# EAGLE design RFRxTx_2550_a (EAGLE 7.3.0)
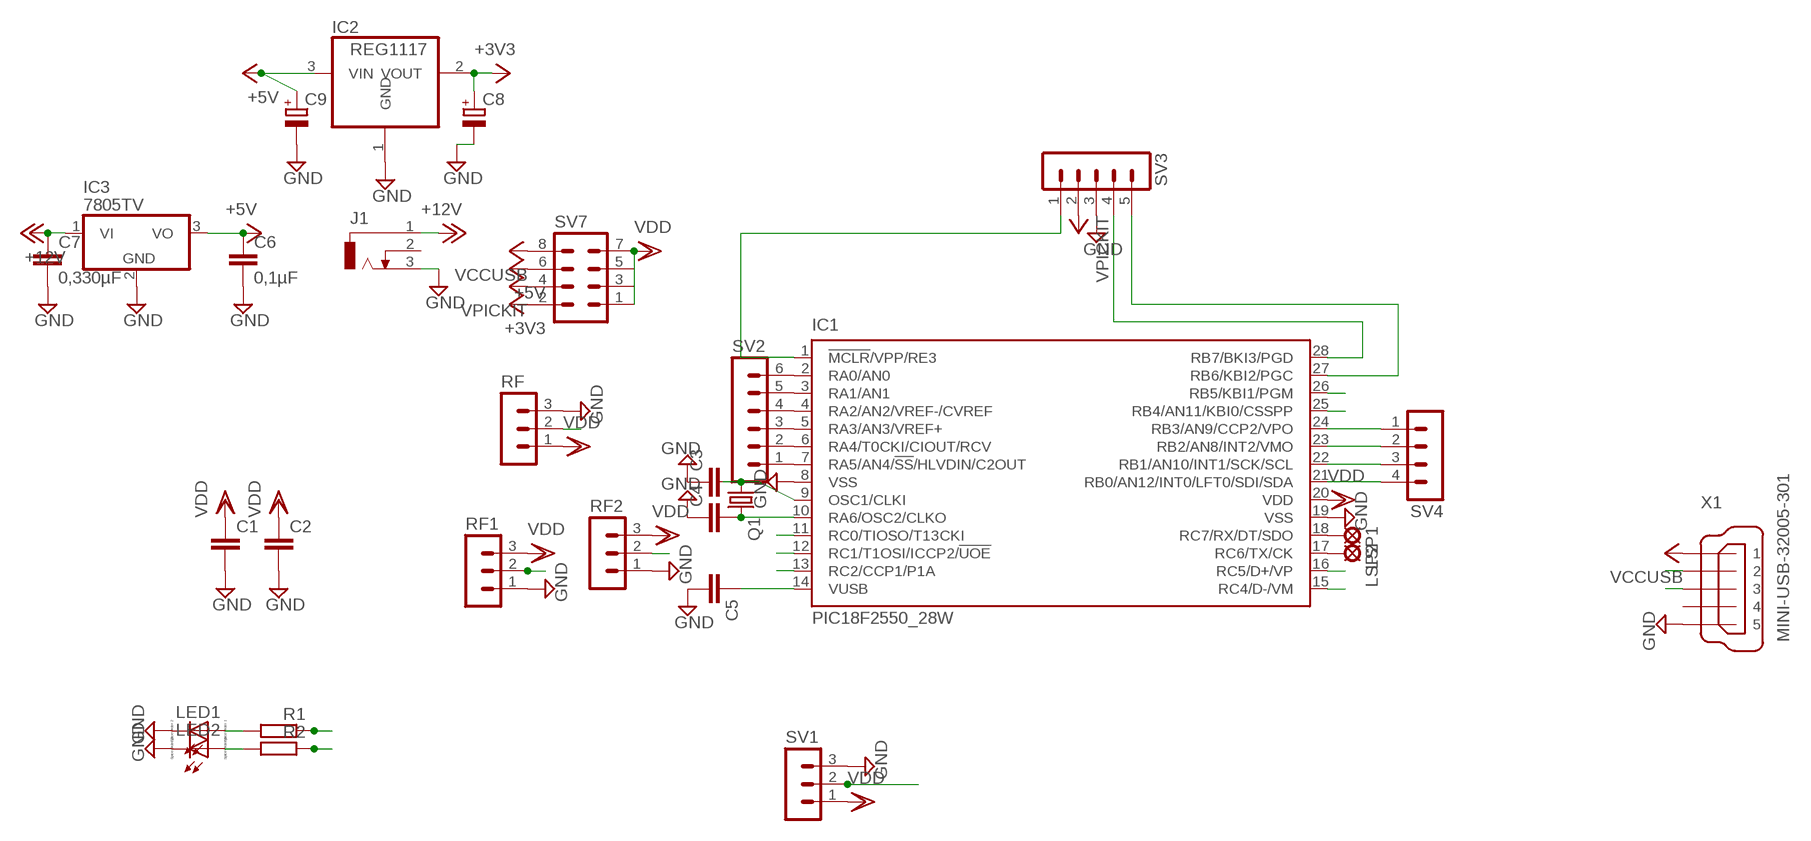
[diagram p0: schematic, sheet 1]

## Parts
C1  C-EUC0805  [C0805]
C2  C-EUC0805  [C0805]
C3  C-EUC0805  [C0805]
C4  C-EUC0805  [C0805]
C5  C-EUC0805  [C0805]
C6  0,1µF  C-EUC0805  [C0805]
C7  0,330µF  C-EUC0805  [C0805]
C8  CPOL-EU153CLV-0405  [153CLV-0405]
C9  CPOL-EU153CLV-0405  [153CLV-0405]
IC1  PIC18F2550_28W  [SO28W]
IC2  REG1117  [SOT223]
IC3  7805TV  [TO220V]
J1  DCJ0303  [DCJ0303]
LED1  LED_ESML0603  [LED_SML0603]
LED2  LED_ESML0603  [LED_SML0603]
LSP1  LSP10  [LSP10]
LSP2  LSP10  [LSP10]
Q1  CRYSTALSM49  [SM49]
R1  R-EU_R0805  [R0805]
R2  R-EU_R0805  [R0805]
RF  MA03-1  [MA03-1]
RF1  MA03-1  [MA03-1]
RF2  MA03-1  [MA03-1]
SV1  MA03-1  [MA03-1]
SV2  MA06-1  [MA06-1]
SV3  MA05-1  [MA05-1]
SV4  MA04-1  [MA04-1]
SV7  MA04-2  [MA04-2]
X1  MINI-USB-32005-301  [32005-301]

## Nets
+3V3: C8.+ IC2.2(VOUT) SV7.2
+5V: C6.1 C9.+ IC2.3(VIN) IC3.3(VO) SV7.6
+12V: C7.1 IC3.1(VI) J1.1
CCP2: IC1.24(RB3/AN9/CCP2/VPO) SV1.2 SV4.1
D+: IC1.16(RC5/D+/VP) X1.3
D-: IC1.15(RC4/D-/VM) X1.2
GND: C1.2 C2.2 C3.1 C4.1 C5.2 C6.2 C7.2 C8.- C9.- IC1.8(VSS) IC1.19(VSS) IC2.1(GND) IC3.2(GND) J1.3 LED1.C LED2.C RF1.1 RF2.1 RF.3 SV1.3 SV3.3 X1.5
IR: IC1.13(RC2/CCP1/P1A) RF1.2
N$1: IC1.7(RA5/AN4/!SS!/HLVDIN/C2OUT) SV2.1
N$2: IC1.6(RA4/T0CKI/CIOUT/RCV) SV2.2
N$3: IC1.5(RA3/AN3/VREF+) SV2.3
N$4: IC1.4(RA2/AN2/VREF-/CVREF) SV2.4
N$5: IC1.3(RA1/AN1) SV2.5
N$6: IC1.2(RA0/AN0) SV2.6
N$9: IC1.23(RB2/AN8/INT2/VMO) SV4.2
N$10: IC1.1(!MCLR!/VPP/RE3) SV3.1
N$11: IC1.28(RB7/BKI3/PGD) SV3.4
N$12: IC1.27(RB6/KBI2/PGC) SV3.5
N$13: IC1.22(RB1/AN10/INT1/SCK/SCL) SV4.3
N$14: IC1.21(RB0/AN12/INT0/LFT0/SDI/SDA) SV4.4
N$15: IC1.18(RC7/RX/DT/SDO) LSP1.MP
N$16: IC1.17(RC6/TX/CK) LSP2.MP
N$23: C4.2 IC1.10(RA6/OSC2/CLKO) Q1.2
N$24: C3.2 IC1.9(OSC1/CLKI) Q1.1
N$30: C5.1 IC1.14(VUSB)
N$35: LED1.A R1.2
N$36: LED2.A R2.2
RB4: IC1.25(RB4/AN11/KBI0/CSSPP) R2.1
RB5: IC1.26(RB5/KBI1/PGM) R1.1
RC0: IC1.11(RC0/TIOSO/T13CKI) RF2.2
RF: IC1.12(RC1/T1OSI/ICCP2/!UOE) RF.2
VCC: SV3.2 SV7.4 ; supply symbol labelled VPICKIT
VDD: C1.1 C2.1 IC1.20(VDD) RF1.3 RF2.3 RF.1 SV1.1 SV7.1 SV7.3 SV7.5 SV7.7
VUSB: SV7.8 X1.1 ; supply symbol labelled VCCUSB
Unconnected: J1.2 X1.4

## Library data of the parts
C1-C5 = rcl:C-EU: CAPACITOR, European symbol
C6 C7 = resistor:C-EU: CAPACITOR, European symbol
C8 C9 = rcl:CPOL-EU: POLARIZED CAPACITOR, European symbol
IC1 = microchip:PIC18F2*_28: USB Microcontrollers with nanoWatt Technology High-Performance, Enhanced Flash, 28/40/44-Pin, Source: http://ww1.microchip.com/downloads/en/devicedoc/39632c.pdf; MF: MICROCHIP; MPN: PIC18F2550-I/SO; OC_FARNELL: 9321268; OC_NEWARK: 73K1297
IC2 = burr-brown:REG1117: 800mA and 1A Low Dropout (LDO) Positive Regulator 1.8V, 2.5V, 2.85V, 3.3V, 5V, and Adj; MPN: REG1117; OC_FARNELL: 1097566; OC_NEWARK: 14P6981
IC3 = linear:78*: Positive VOLTAGE REGULATOR Source: http://cache.national.com/ds/LM/LM78L05.pdf http://www.fairchildsemi.com/ds/LM/LM7805.pdf
J1 = con-jack:DCJ0303: DC POWER JACK Source: DCJ0303.pdf; OC_FARNELL: unknown; OC_NEWARK: unknown
LED1 LED2 = eagle-ltspice:LED_E: LED Source: http://www.osram.convergy.de Source: www.luxeon.com Source: www.kingbright.com; SPICEMODEL: NONE; SPICEPREFIX: D; SPICETYPE: diode
LSP1 LSP2 = solpad:LSP10: SOLDER PAD drill 1.0 mm, distributor Buerklin, 12H555
Q1 = crystal:CRYSTAL: CRYSTAL; OC_FARNELL: unknown; OC_NEWARK: unknown
R1 R2 = rcl:R-EU_: RESISTOR, European symbol
RF RF1 RF2 SV1 = con-lstb:MA03-1: PIN HEADER; OC_FARNELL: unknown; OC_NEWARK: unknown
SV2 = con-lstb:MA06-1: PIN HEADER; OC_FARNELL: unknown; OC_NEWARK: unknown
SV3 = con-lstb:MA05-1: PIN HEADER; OC_FARNELL: unknown; OC_NEWARK: unknown
SV4 = con-lstb:MA04-1: PIN HEADER; OC_FARNELL: unknown; OC_NEWARK: unknown
SV7 = con-lstb:MA04-2: PIN HEADER; OC_FARNELL: unknown; OC_NEWARK: unknown
X1 = con-cypressindustries:MINI-USB-: MINI USB-B Conector Source: www.cypressindustries.com; OC_FARNELL: unknown; OC_NEWARK: unknown

## Board
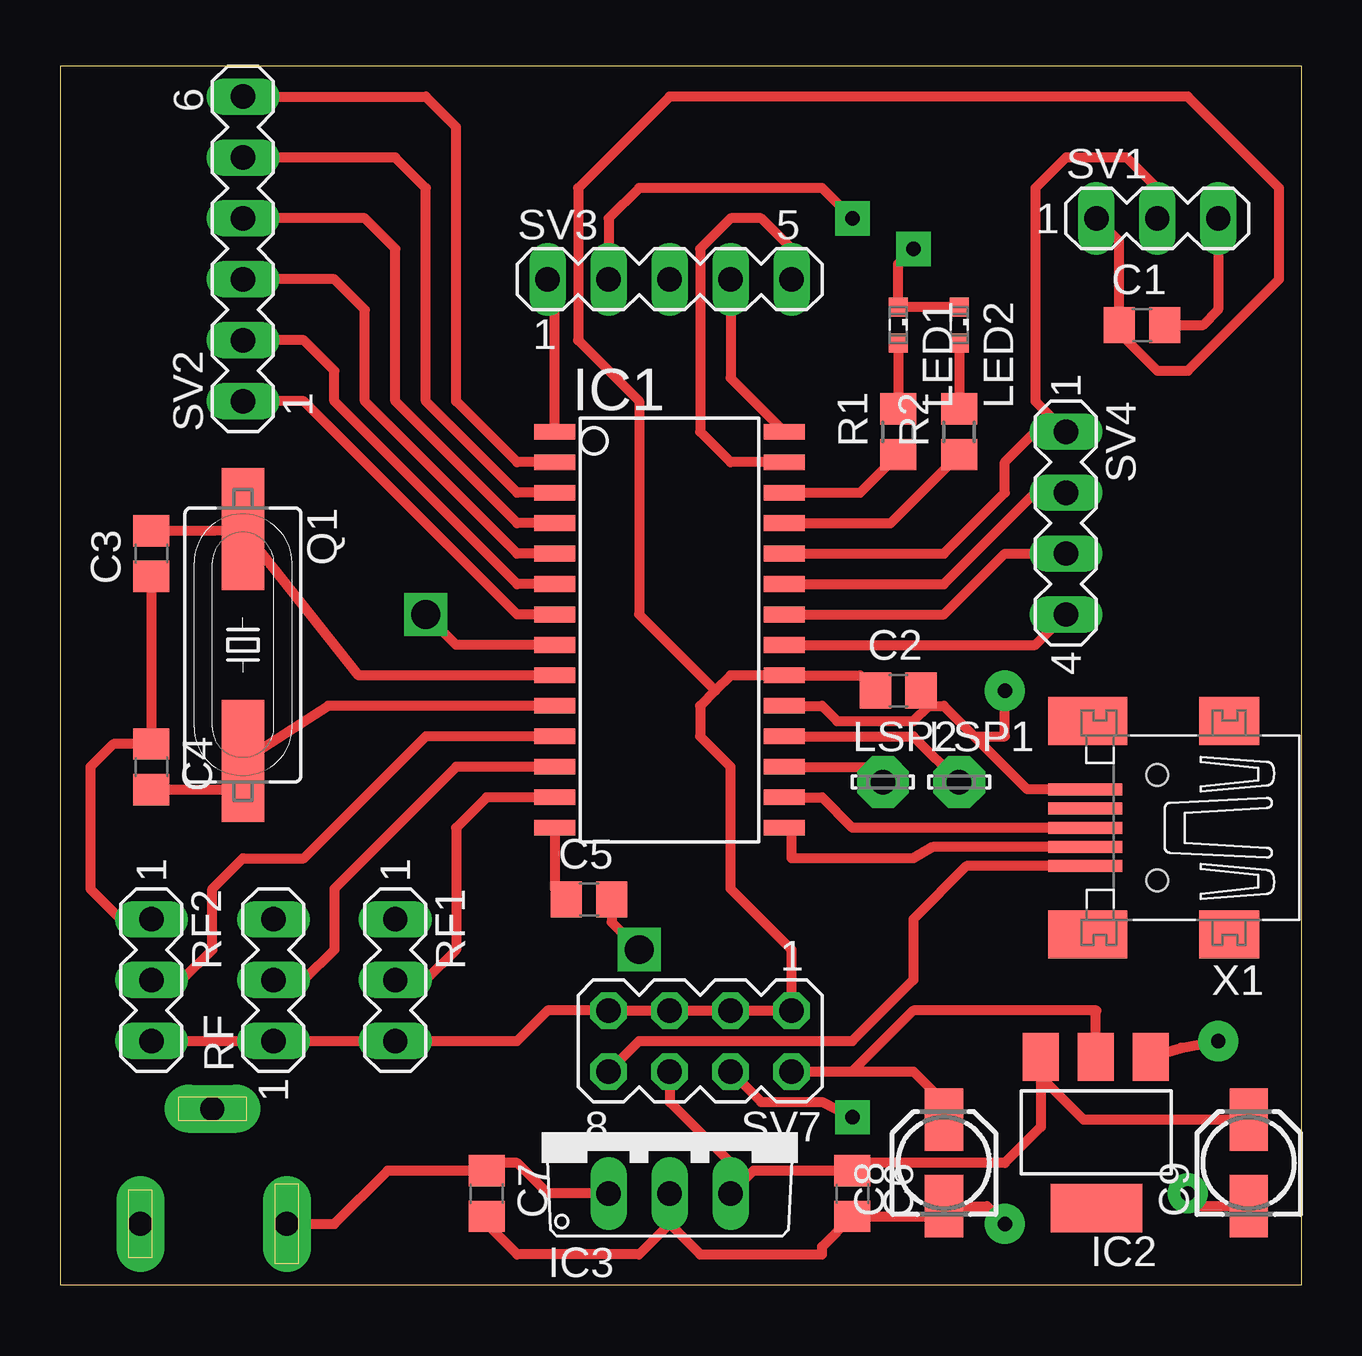
[diagram p1: board, top side]
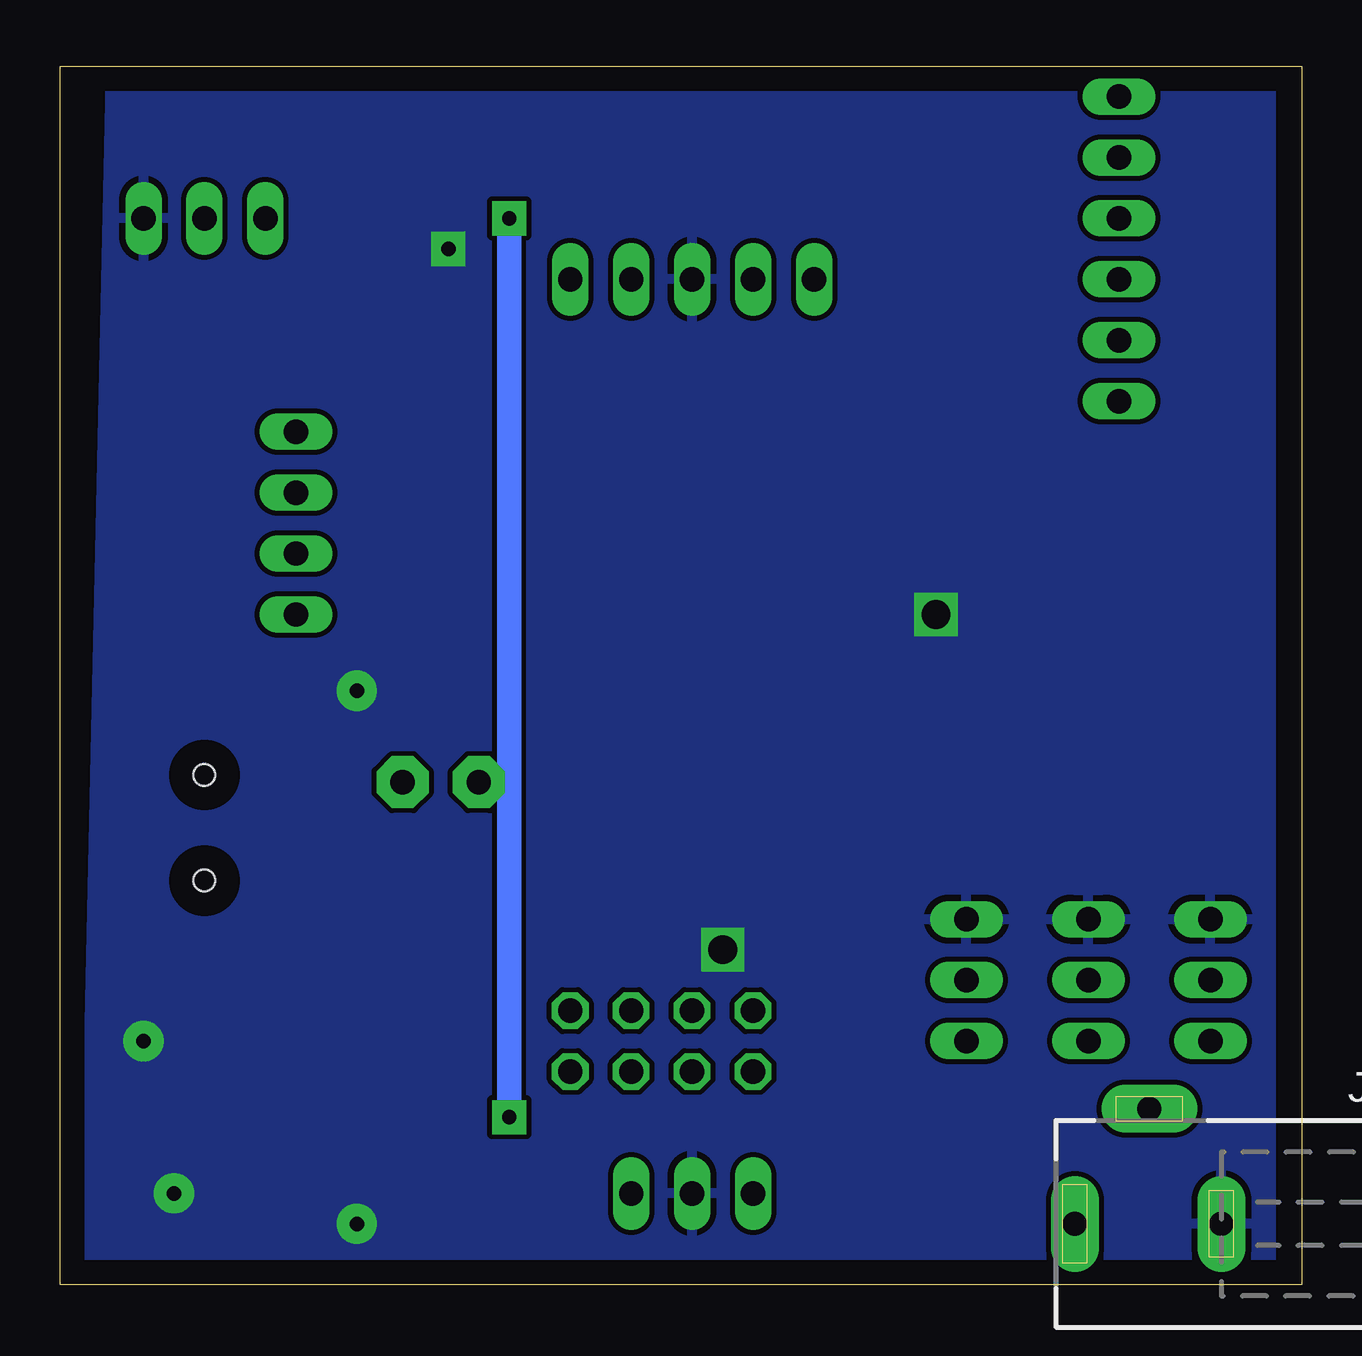
[diagram p2: board, bottom side, seen from below]

Size 51.74 x 50.79 mm. Coordinates in mm from the lower left corner, seen from the top.
Outline: 0,0 51.74,0 51.74,50.79 0,50.79 0,0
Copper layers (1*16): Top 0.035mm / dielectric 1.5mm / Bottom 0.035mm
Design rules "default *": minimum track width 10mil, minimum drill 24mil, track to track 8mil, track to pad 8mil, pad to pad 8mil, via to via 8mil, smd to smd 8mil, copper to edge 40mil, drill to drill 8mil, minimum pad ring 8mil, minimum via ring 8mil, stop-mask expansion 4mil, vias tented up to drill 0mil, thermal gap 10mil

### Footprints (pad centres in the part's own frame; a part is rotated, then mirrored left to right if it is on the bottom)
C0805 = smd 1.3 x 1.5: 1 -0.95,0; 2 0.95,0
153CLV-0405 = smd 2.6 x 1.6: + 1.8,0; - -1.8,0
SO28W = smd 0.65 x 1.7: 1 -7.62,-4.78; 2 -6.35,-4.78; 3 -5.08,-4.78; 4 -3.81,-4.78; 5 -2.54,-4.78; 6 -1.27,-4.78; 7 0,-4.78; 8 1.27,-4.78; 9 2.54,-4.78; 10 3.81,-4.78; 11 5.08,-4.78; 12 6.35,-4.78; 13 7.62,-4.78; 14 8.89,-4.78; 15 8.89,4.78; 16 7.62,4.78; 17 6.35,4.78; 18 5.08,4.78; 19 3.81,4.78; 20 2.54,4.78; 21 1.27,4.78; 22 0,4.78; 23 -1.27,4.78; 24 -2.54,4.78; 25 -3.81,4.78; 26 -5.08,4.78; 27 -6.35,4.78; 28 -7.62,4.78
SOT223 = smd 1.499 x 2.007: 1 -2.261,-3.15; 2 0.025,-3.15; 3 2.311,-3.15 | smd 3.81 x 2.007: 4 0,3.15
TO220V = drill 1.016 long: 1 -2.54,-2.54; 2 0,-2.54; 3 2.54,-2.54
DCJ0303 = drill 1 pad 2 long: 1 0,3.1; 2 4.8,0; 3 0,-3
LED_SML0603 = smd 0.8 x 0.8: A 0.75,0; C -0.75,0
LSP10 = drill 1.016 pad 2.159 octagon: MP 0,0
SM49 = smd 5.08 x 1.778: 1 -4.826,0; 2 4.826,0
R0805 = smd 1.3 x 1.5: 1 -0.95,0; 2 0.95,0
MA03-1 = drill 1.016 long: 1 -2.54,0; 2 0,0; 3 2.54,0
MA06-1 = drill 1.016 long: 1 -6.35,0; 2 -3.81,0; 3 -1.27,0; 4 1.27,0; 5 3.81,0; 6 6.35,0
MA05-1 = drill 1.016 long: 1 -5.08,0; 2 -2.54,0; 3 0,0; 4 2.54,0; 5 5.08,0
MA04-1 = drill 1.016 long: 1 -3.81,0; 2 -1.27,0; 3 1.27,0; 4 3.81,0
MA04-2 = drill 1.016 octagon: 1 -3.81,-1.27; 2 -3.81,1.27; 3 -1.27,-1.27; 4 -1.27,1.27; 5 1.27,-1.27; 6 1.27,1.27; 7 3.81,-1.27; 8 3.81,1.27
32005-301 = smd 3.1 x 0.5: 1 3,1.6; 2 3,0.8; 3 3,0; 4 3,-0.8; 5 3,-1.6 | smd 2.5 x 2: M1 -3,-4.45; M2 -3,4.45 | smd 3.3 x 2: M3 2.9,4.45; M4 2.9,-4.45 | hole 0.9: 0,2.2; 0,-2.2

### Placement (x,y rotation side)
C1  45.09,40.01 0 top
C2  34.93,24.77 0 top
C3  3.81,30.48 90 top
C4  3.81,21.59 270 top
C5  22.04,16.06 0 top
C6  33.02,3.81 270 top
C7  17.78,3.81 270 top
C8  36.83,5.08 90 top
C9  49.53,5.08 90 top
IC1  25.4,27.94 270 top
IC2  43.18,6.35 180 top
IC3  25.4,6.35 0 top
J1  6.35,2.54 90 bottom
LED1  34.93,40.01 270 top
LED2  37.47,40.01 270 top
LSP1  37.47,20.95 0 top
LSP2  34.29,20.95 0 top
Q1  7.62,26.67 270 top
R1  34.93,35.56 90 top
R2  37.47,35.56 90 top
RF  8.89,12.7 90 top
RF1  13.97,12.7 270 top
RF2  3.81,12.7 270 top
SV1  45.72,44.45 0 top
SV2  7.62,43.18 90 top
SV3  25.4,41.91 0 top
SV4  41.91,31.75 270 top
SV7  26.67,10.16 180 top
X1  45.72,19.05 180 top

### Tracks (layer width: path | path; a pad name or v marks a point on that pad's centre or on a via)
+3V3
  Top 0.406: SV7.2 33.02,8.89 | 33.02,8.89 35.56,8.89 36.83,7.62 C8.+ | IC2.2 43.16,11.4 43.18,11.43 35.56,11.43 33.02,8.89
+5V
  Top 0.406: C9.+ 42.65,6.88 40.87,8.66 | IC2.3 40.87,8.66 | 40.87,8.66 40.87,6.58 39.37,5.08 33.34,5.08 C6.1 28.89,4.76 IC3.3 27.94,5.08 25.4,7.62 SV7.6
+12V
  Top 0.406: IC3.1 20.32,3.81 19.05,5.08 18.1,5.08 C7.1 13.65,4.76 11.43,2.54 J1.1
CCP2
  Top 0.406: IC1.24 36.83,30.48 39.37,33.02 39.37,34.29 40.64,35.56 SV4.1 40.64,36.83 40.64,45.72 41.91,46.99 44.45,46.99 45.72,45.72 SV1.2
D+
  Top 0.406: IC1.16 31.75,20.32 33.02,19.05 X1.3
D-
  Top 0.406: X1.2 36.36,18.25 35.56,17.78 30.48,17.78 30.48,19.05 IC1.15
GND  (via drill 0.6 pad 1.42, 0.6 pad 1.68, 1.2)
  Top 0.406: LED2.C LED1.C 34.93,42.55 v35.56,43.18 | IC3.2 25.4,2.54 | 25.4,2.54 26.67,1.27 31.75,1.27 31.75,1.59 C6.2 36.41,2.86 C8.- 38.63,3.28 v39.37,2.54 | IC2.1 46.71,9.88 v48.26,10.16 | C9.- 47.52,3.28 v46.99,3.81 | X1.5 40.31,20.65 38.1,22.86 | 38.1,22.86 36.83,24.13 36.2,24.13 | IC1.8 16.51,26.67 v15.24,27.94 | C3.1 C4.1 2.22,22.54 1.27,21.59 1.27,16.51 2.54,15.24 RF2.1 | C5.2 22.99,15.11 v24.13,13.97 | IC1.19 31.75,24.13 32.38,23.5 35.56,23.5 36.2,24.13 | 36.2,24.13 36.2,24.45 C2.2 | 38.1,22.86 39.37,22.86 v39.37,24.77 | SV1.3 48.26,40.64 47.62,40.01 C1.2 | 25.4,2.54 24.13,1.27 19.05,1.27 17.78,2.54 C7.2
  pour Bottom: 1.27,55.88 49.53,55.88 50.8,-1.27 1.27,-1.27
IR
  Top 0.406: IC1.13 17.78,20.32 16.51,19.05 16.51,13.97 15.24,12.7 RF1.2
N$1
  Top 0.406: IC1.7 19.05,27.94 10.16,36.83 SV2.1
N$2
  Top 0.406: IC1.6 19.05,29.21 11.43,36.83 11.43,38.1 10.16,39.37 SV2.2
N$3
  Top 0.406: IC1.5 19.05,30.48 12.7,36.83 12.7,40.64 11.43,41.91 SV2.3
N$4
  Top 0.406: IC1.4 19.05,31.75 13.97,36.83 13.97,43.18 12.7,44.45 SV2.4
N$5
  Top 0.406: IC1.3 19.05,33.02 15.24,36.83 15.24,45.72 13.97,46.99 SV2.5
N$6
  Top 0.406: IC1.2 19.05,34.29 16.51,36.83 16.51,48.26 15.24,49.53 SV2.6
N$9
  Top 0.406: IC1.23 36.83,29.21 40.64,33.02 SV4.2
N$10
  Top 0.406: IC1.1 20.62,41.61 SV3.1
N$11
  Top 0.406: SV3.4 27.94,37.8 IC1.28
N$12
  Top 0.406: SV3.5 30.48,43.18 29.21,44.45 27.94,44.45 26.67,43.18 26.67,35.56 27.94,34.29 IC1.27
N$13
  Top 0.406: IC1.22 36.83,27.94 39.37,30.48 SV4.3
N$14
  Top 0.406: IC1.21 40.64,26.67 SV4.4
N$15
  Top 0.406: IC1.18 35.56,22.86 LSP1.MP
N$16
  Top 0.406: IC1.17 33.66,21.59 LSP2.MP
N$23
  Top 0.406: IC1.10 11.18,24.13 Q1.2 7.55,20.64 C4.2
N$24
  Top 0.406: IC1.9 12.45,25.4 Q1.1 6.42,31.43 C3.2
N$30
  Top 0.406: IC1.14 20.62,16.49 C5.1
N$35
  Top 0.406: LED1.A R1.2
N$36
  Top 0.406: LED2.A R2.2
RB4
  Top 0.406: IC1.25 34.61,31.75 R2.1
RB5
  Top 0.406: IC1.26 33.34,33.02 R1.1
RC0
  Top 0.406: RF2.2 5.08,12.7 6.35,13.97 6.35,16.51 7.62,17.78 10.16,17.78 15.24,22.86 IC1.11
RF
  Top 0.406: IC1.12 16.51,21.59 11.43,16.51 11.43,13.97 10.16,12.7 RF.2
VCC  (via drill 0.6 pad 1.42)
  Top 0.406: SV7.4 29.21,7.62 31.75,7.62 v33.02,6.98 | v33.02,44.45 31.75,45.72 24.13,45.72 22.86,44.45 SV3.2
  Bottom 1.016: v33.02,6.98 v33.02,44.45
VDD
  Top 0.406: 27.3,24.77 27.94,25.4 IC1.20 33.34,25.4 C2.1 | 27.3,24.77 26.67,24.13 26.67,22.86 27.94,21.59 27.94,16.51 30.48,13.97 SV7.1 SV7.3 SV7.5 SV7.7 20.32,11.43 19.05,10.16 RF1.3 RF.1 RF2.3 | SV1.1 44.14,43.5 C1.1 44.14,39.69 45.72,38.1 46.99,38.1 50.8,41.91 50.8,45.72 46.99,49.53 25.4,49.53 21.59,45.72 21.59,39.37 24.13,36.83 24.13,27.94 27.3,24.77
VUSB
  Top 0.406: SV7.8 24.13,10.16 33.02,10.16 35.56,12.7 35.56,15.24 37.77,17.45 X1.1

### Text on the board
Top: RC0 && RC1 are only input with timer1